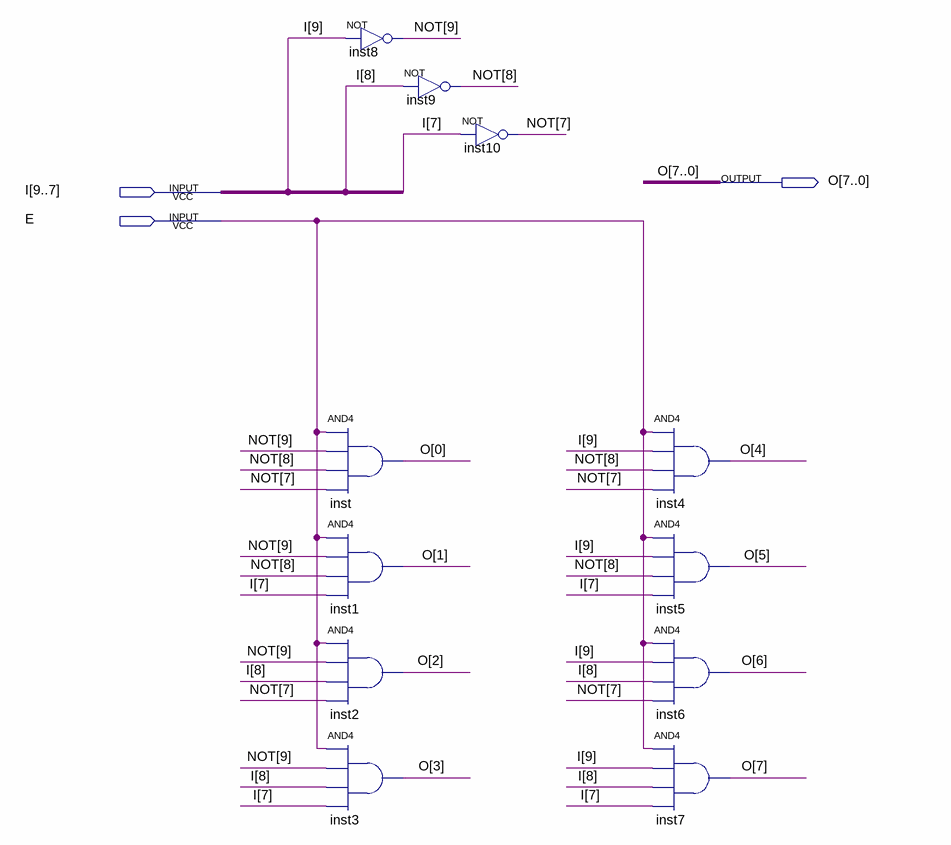
[diagram p0: schematic sheet]
// Quartus schematic Dec3_8_A2.bdf as structural Verilog: 11 symbols, 3 pins
module Dec3_8_A2 (
  input  [9:7] I,
  input  E,
  output [7:0] O
);

  wire [9:7] NOT;

  not inst8 (NOT[9], I[9]);
  and inst (O[0], E, NOT[9], NOT[8], NOT[7]);
  and inst1 (O[1], E, NOT[9], NOT[8], I[7]);
  and inst2 (O[2], E, NOT[9], I[8], NOT[7]);
  and inst3 (O[3], E, NOT[9], I[8], I[7]);
  not inst9 (NOT[8], I[8]);
  not inst10 (NOT[7], I[7]);
  and inst4 (O[4], E, I[9], NOT[8], NOT[7]);
  and inst5 (O[5], E, I[9], NOT[8], I[7]);
  and inst6 (O[6], E, I[9], I[8], NOT[7]);
  and inst7 (O[7], E, I[9], I[8], I[7]);
endmodule
